# Altium schematic sheet Power Circuit.SchDoc
size A4; SheetNumber: 1; SheetTotal: 1
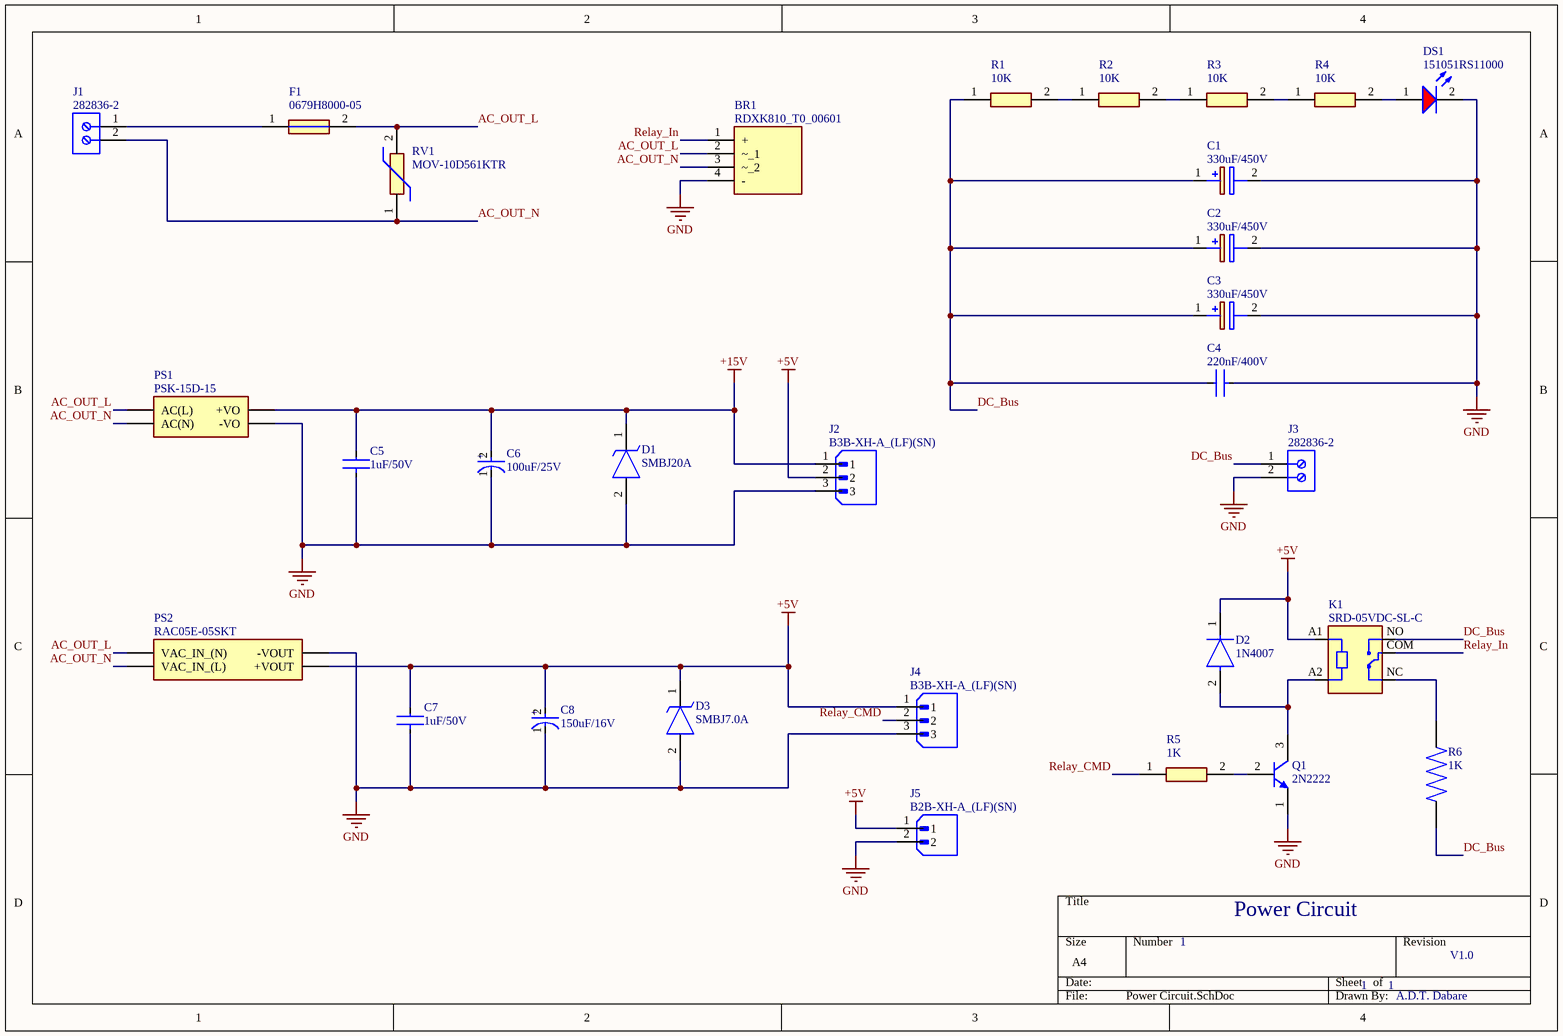
[diagram p0: Power Circuit.SchDoc]

## Parts
BR1  RDXK810_T0_00601  [RDXK810_T0_00601]
C1  330uF/450V  [CAPPRD1000W190D3050H3200]
C2  330uF/450V  [CAPPRD1000W190D3050H3200]
C3  330uF/450V  [CAPPRD1000W190D3050H3200]
C4  220nF/400V  [FP-CK06BX105K-MFG]
C5  1uF/50V  [FP-CK06BX105K-MFG]
C6  100uF/25V  [FP-RAD-TH-D_6_3_0_5-L_11-MFG]
C7  1uF/50V  [FP-CK06BX105K-MFG]
C8  150uF/16V  [FP-RAD-TH-D_6_3_0_5-L_11-MFG]
D1  SMBJ20A  [DIOM5436X244N]
D2  1N4007  [FP-1N4007-MFG]
D3  SMBJ7.0A  [DIOM5443X244N]
DS1  151051RS11000  [WL-TMRC_D5.9H8.7]
F1  0679H8000-05  [FUSC6125X279N]
J1  282836-2  [TECO-282836-2_V]
J2  B3B-XH-A_(LF)(SN)  [JST_B3B-XH-A (LF)(SN)]
J3  282836-2  [TECO-282836-2_V]
J4  B3B-XH-A_(LF)(SN)  [JST_B3B-XH-A (LF)(SN)]
J5  B2B-XH-A_(LF)(SN)  [JST_B2B-XH-A_(LF)(SN)]
K1  SRD-05VDC-SL-C  [RELAY_SRD-05VDC-SL-C]
PS1  PSK-15D-15  [PSK15D15]
PS2  RAC05E-05SKT  [RAC05E05SKT]
Q1  2N2222  [MLTC-TO-18-3]
R1  10K  [RESC6331X80N]
R2  10K  [RESC6331X80N]
R3  10K  [RESC6331X80N]
R4  10K  [RESC6331X80N]
R5  1K  [RESC3225X70N]
R6  1K  [RESAD2860W80L2200D950]
RV1  MOV-10D561KTR  [MOV10D561KTR]

## Nets
+5V: C7.2 C8.2(A) D2.1(C) D3.1(K) J2.2 J4.1 J5.1 K1.A1 PS2.7(+VOUT)
+15V: C5.2 C6.2(A) D1.1(K) J2.1 PS1.4(+VO)
GND: BR1.4(-) C1.2(-) C2.2(-) C3.2(-) C4.1 C5.1 C6.1(C) C7.1 C8.1(C) D1.2(A) D3.2(A) DS1.2(K) J2.3 J3.2 J4.3 J5.2 PS1.3(-VO) PS2.9(-VOUT) Q1.1(E)
AC_OUT_L: BR1.2(~_1) F1.2 PS1.1(AC(L)) PS2.1(VAC_IN_(N)) RV1.2
AC_OUT_N: BR1.3(~_2) J1.2 PS1.2(AC(N)) PS2.5(VAC_IN_(L)) RV1.1
DC_Bus: C1.1(+) C2.1(+) C3.1(+) C4.2 J3.1 K1.NO R1.1 R6.1
Relay_CMD: J4.2 R5.1
Relay_In: BR1.1(+) K1.COM
NetD2_2: D2.2(A) K1.A2 Q1.3(C)
NetDS1_1: DS1.1(A) R4.2
NetF1_1: F1.1 J1.1
NetK1_NC: K1.NC R6.2
NetQ1_2: Q1.2(B) R5.2
NetR1_2: R1.2 R2.1
NetR2_2: R2.2 R3.1
NetR3_2: R3.2 R4.1

## Notes on the sheet
- Power Circuit
- 1
- V1.0
- A.D.T. Dabare
- (in symbol CMP-05427-000141-1) +

## Library data of the parts
BR1 = RDXK810_T0_00601: Bridge Rectifier; Manufacturer_Name: PANJIT; Datasheet Link: https://www.panjit.com.tw/upload/datasheet/RDXK810.pdf; Height: 12.9mm; Manufacturer_Part_Number: RDXK810_T0_00601; Mouser Part Number: 241-RDXK810_T0_00601; Mouser Price/Stock: https://www.mouser.co.uk/ProductDetail/Panjit/RDXK810_T0_00601?qs=pBunHO6%252BwtELvZflFp%2FYiw%3D%3D
C1-C3 = B43647B5337M057: Capacitor Polarised; Manufacturer_Name: TDK; Datasheet Link: https://product.tdk.com/system/files/dam/doc/product/capacitor/aluminum-electrolytic/snap-in/data_sheet/20/30/db/aec/b43647.pdf; Height: 32mm; Manufacturer_Part_Number: B43647B5337M057; Mouser Part Number: 871-B43647B5337M057; Mouser Price/Stock: https://www.mouser.co.uk/ProductDetail/EPCOS-TDK/B43647B5337M057?qs=vmHwEFxEFR%2FSdH8%2FO0wcVA%3D%3D
C4 C5 C7 = CMP-03020-034658-1: CAP CER 1UF 50V BX RADIAL; Dissipation Factor: 2.5%; Lead Diameter: 0.635mm; Lead/Base Style: Straight; Pitch: 5.08mm; Tolerance: 10%; Dielectric: X7R; Radiation Hardening: No; Series: Military, MIL-C-11015, CK06; RoHS Compliant: No; Resistor Type: Ceramic; Lead Pitch: 5.08mm; Voltage Rating: 50V; Depth: 2.29mm; Length: 7.37mm; Termination: Radial; Height: 7.37mm; Package Quantity: 100; Mount: Through Hole; Construction: RADIAL; Packaging: Bulk; Capacitance: 1uF; Max Operating Temperature: 125°C; Case/Package: Molded; Voltage Rating (DC): 50V; REACH SVHC: No SVHC; Features: Military; Min Operating Temperature: -55°C; Width: 0.09inch; Number of Pins: 2; Height - Seated (Max): 0.3inch
C6 C8 = CMP-05427-000141-1: Aluminum Electrolytic Capacitors (Radial Lead Type) AEC-Q200 Qualified 100uF ±20% 25V; Lead Diameter: 0.5mm; Life (Hours): 1000Hour; Ripple Current: 130mA; Lead/Base Style: Straight; Construction: RADIAL; Radiation Hardening: No; Packaging: Ammo Pack; Termination: Radial; Mount: Through Hole; Lead Pitch: 2.5mm; Tolerance: 20%; Height - Seated (Max): 0.48inch; Height: 11.2mm; Max Operating Temperature: 105°C; Length: 11.2mm; Diameter: 6.3mm; RoHS Compliant: Yes; Voltage Rating: 25V; Min Operating Temperature: -55°C; Package Quantity: 2000; Capacitance: 100uF; Width: 6.3mm; Voltage Rating (DC): 25V; Series: NHG; Contact Plating: Tin; Case/Package: Radial
D1 = SMBJ20A: TVS Diode (Uni-directional); Manufacturer_Name: Bourns; Datasheet Link: https://www.bourns.com/docs/product-datasheets/smbj.pdf?sfvrsn=34552159_17; Height: 2.44mm; Manufacturer_Part_Number: SMBJ20A; Mouser Part Number: 652-SMBJ20A; Mouser Price/Stock: https://www.mouser.co.uk/ProductDetail/Bourns/SMBJ20A?qs=%252Bf8Cd6aE5bx0luBLnSoXTg%3D%3D; Arrow Part Number: SMBJ20A; Arrow Price/Stock: https://www.arrow.com/en/products/smbj20a/bourns?region=nac
D2 = CMP-123542-000001-1: Rectifier diode 1000 V 1 A DO-41, ,; Manufacturer: Diotec; Max Surge Forward Current: 27A; Forward Current: 1A; Max Junction Temp: +175°C; Reverse Voltage: 1000V; Value: 15pF; Peak Reverse Current: 5uA; Category: Diode; Temperature Range Low: -50°C; Automotive: No; Temperature: -50°C to +175°C; Lead Free: Yes; ComponentLink2Description: Datasheet; Max Repetitive Reverse Voltage: 1000V; ComponentLink2URL: https://datasheet.octopart.com/1N4007-Diotec-datasheet-62346875.pdf; Manufacturer Part Number: 1N4007; Device Class L3: Rectifier Diodes; Height: 2.8mm; Octopart: https://octopart.com/1n4007-diotec-4040411; Package: 1N4007; Temperature Range High: +175°C; Device Class L1: Discrete Semiconductors; Device Class L2: Diodes; RoHS: TRUE; Capacitance: 15pF; Ipc Land Pattern Name: DIOAD888W100L520D280
D3 = SMBJ7.0A: TVS Diode (Uni-directional); Manufacturer_Name: Bourns; Datasheet Link: https://www.bourns.com/docs/Product-Datasheets/SMBJ.pdf; Height: 2.44mm; Manufacturer_Part_Number: SMBJ7.0A; Mouser Part Number: 652-SMBJ7.0A; Mouser Price/Stock: https://www.mouser.co.uk/ProductDetail/Bourns/SMBJ7.0A?qs=%252Bf8Cd6aE5bwMIb6NdbDGfg%3D%3D; Arrow Part Number: SMBJ7.0A; Arrow Price/Stock: https://www.arrow.com/en/products/smbj7.0a/bourns?region=nac
DS1 = CMP-1488-00008-2: NexarPartId: 29717813; Lens Style: Circular, Diffused, Round; Lens Size: 5mm; Forward Voltage: 2.1V; Peak Wavelength: 650nm; Forward Current: 100mA; Viewing Angle: 60°; Color: Red; Wavelength: 630nm; Test Current: 20mA; Dominant Wavelength: 645nm; Luminous Intensity: 30mcd; Max Reverse Voltage (DC): 5V; Height: 8.6mm; Length: 5mm; Min Operating Temperature: -40°C; Max Operating Temperature: 85°C; Packaging: Bulk; REACH SVHC: Unknown; Case/Package: Radial; RoHS: Compliant; Width: 5mm; Mount: Through Hole
F1 = 0679H8000-05: Fuse; Manufacturer_Name: Bel Circuit Protection; Datasheet Link: https://www.mouser.ec/datasheet/2/643/ds_cp_0679h_series-1290853.pdf; Height: 2.79mm; Manufacturer_Part_Number: 0679H8000-05; Arrow Part Number: 0679H8000-05; Arrow Price/Stock: https://www.arrow.com/en/products/0679h8000-05/bel-group?region=nac
J1 J3 = CMP-1684-00017-1: Female Header, Pitch 5 mm, 1 x 2 Position, Height 10 mm, Tail Length 3.5 mm, Rohs, Bulk; Manufacturer: TE Connectivity; Wire Gauge: 16-30AWG; Product Training Modules: Wire-to-BoardEurostyleTerminalBlocks; Clamp Material - Plating: Brass-NickelPlated; Voltage: 300V; Mating Orientation: HorizontalwithBoard; Current: 13.5A; Pitch: 0.197"(5.00mm); Screw Thread: M3; 3D Model: 282836-2.pdf; Other Names: 5ULV-02B / A98076; Dynamic Catalog: BuchananSeries; Number of Levels: 1; Torque - Screw: 0.68Nm(6Lb-In); Featured Product: EurostyleTerminalBlockConnectors; Positions Per Level: 2; Wire Termination: Screw-RisingCageClamp; Datasheet URL: http://www.te.com.cn/commerce/DocumentDelivery/DDEController?Action=showdoc&DocId=Catalog+Section%7F1308389_EUROSTYLE_TERMINAL_BLOCKS%7F0607%7Fpdf%7FEnglish%7FENG_CS_1308389_EUROSTYLE_TERMINAL_BLOCKS_0607.pdf%7F282836-2; Color: Green; Family: TerminalBlocks-WiretoBoard; RoHS Information: 282836-2StatementofCompliance; Standard Package: 300; Contact Material - Plating: Brass-TinPlated; Manufacturer URL: http://www.te.com; Housing Material: Polyamide(PA66),Nylon6/6; Features: Interlocking(Side); Package Description: Female Header, Pitch 5 mm, 1 x 2 Position, Height 10 mm, Tail Length 3.5 mm; Mounting Type: ThroughHole; Package Reference: THD; Packaging: Bulk; Series: Buchanan; Category: Connectors,Interconnects; Screw Material - Plating: Brass-NickelPlated
J2 J4 = B3B-XH-A_(LF)(SN): Connector Header Through Hole 3 position 0.098 (2.50mm); MF: JST Sales America Inc.; MP: B3B-XH-A (LF)(SN); SnapEDA_Link: https://www.snapeda.com/parts/B3B-XH-A%20(LF)(SN)/JST+Sales+America+Inc./view-part/?ref=snap; Package: None; Value: *; Check_prices: https://www.snapeda.com/parts/B3B-XH-A%20(LF)(SN)/JST+Sales+America+Inc./view-part/?ref=eda
J5 = B2B-XH-A_(LF)(SN): Connector Header Through Hole 2 position 0.098 (2.50mm); MF: JST Sales; MP: B2B-XH-A (LF)(SN); SnapEDA_Link: https://www.snapeda.com/parts/B2B-XH-A%20(LF)(SN)/JST+Sales+America+Inc./view-part/?ref=snap; Package: None; Value: *; Check_prices: https://www.snapeda.com/parts/B2B-XH-A%20(LF)(SN)/JST+Sales+America+Inc./view-part/?ref=eda
K1 = SRD-05VDC-SL-C: 5V Trigger Relay Module For Arduino And Raspberry Pi 5V Trigger Relay Module For Arduino And Raspberry Pi; MF: Songle Relay; Check_prices: https://www.snapeda.com/parts/SRD-05VDC-SL-C/Songle+Relay/view-part/?ref=eda; Value: *; Availability: Not in stock; Price: None; Package: NON STANDARD-5 Songle Relay; MP: SRD-05VDC-SL-C; SnapEDA_Link: https://www.snapeda.com/parts/SRD-05VDC-SL-C/Songle+Relay/view-part/?ref=snap
PS1 = PSK-15D-15: Power Supply; Manufacturer_Name: CUI Inc.; Datasheet Link: https://www.cui.com/product/resource/psk-15d.pdf; Height: 24mm; Manufacturer_Part_Number: PSK-15D-15; Mouser Part Number: 490-PSK-15D-15; Mouser Price/Stock: https://www.mouser.co.uk/ProductDetail/CUI-Inc/PSK-15D-15?qs=DRkmTr78QATxDRJPOzDh%252BA%3D%3D
PS2 = RAC05E-05SKT: Power Supply; Manufacturer_Name: RECOM Power; Datasheet Link: https://recom-power.com/pdf/Powerline_AC-DC/RAC05E-KT.pdf; Height: 22mm; Manufacturer_Part_Number: RAC05E-05SKT; Mouser Part Number: 919-RAC05E-05SKT; Mouser Price/Stock: https://www.mouser.co.uk/ProductDetail/RECOM-Power/RAC05E-05SKT?qs=7D1LtPJG0i1k%2FYw%252BRylc5g%3D%3D; Arrow Part Number: RAC05E-05SKT; Arrow Price/Stock: https://www.arrow.com/en/products/rac05e-05skt/recom-power?region=nac
Q1 = CMP-2000-05237-1: Low Power Bipolar NPN Transistor, 30 V, -65 to 200 degC, 3-Pin TO-18, RoHS, Bulk; Manufacturer: Multicomp; Pin Configuration: a; No. of Pins: 3; No. of Transistors: 1; Collector Emitter Voltage Vces: 400mV; Current Ic Continuous a Max: 800mA; Power Dissipation Pd: 500mW; Collector Emitter Voltage V(br)ceo: 30V; Gain Bandwidth ft Typ: 250MHz; Voltage Vcbo: 60V; DC Current Gain hFE: 100; Full Power Rating Temperature: 25degC; Current Ic @ Vce Sat: 150mA; SVHC: NoSVHC(19-Dec-2012); Package Reference: TO-18-3; Package Description: 3-Pin Transistor Outline Package (TO-18), Dia 5.54 mm, Pitch Pitch 1.485mm; Datasheet URL: http://www.farnell.com/datasheets/1662272.pdf; Transistor Case Style: TO-18; Continuous Collector Current Ic Max: 800mA; Manufacturer URL: http://uk.farnell.com/b/multicomp; DC Collector Current: 800mA; Hfe Min: 100; Transistor Polarity: NPN; Power Dissipation Ptot Max: 500mW; Package / Case: TO-18; Datasheet Version: Rev. 1.1, 05/2012; Gain Bandwidth ft Min: 250MHz; Current Ic hFE: 150mA
R1-R4 = CRM2512QJW-103ELF: Resistor; Manufacturer_Name: Bourns; Datasheet Link: http://www.bourns.com/data/global/pdfs/CRM0805_1206_2010.pdf; Height: 0.8mm; Manufacturer_Part_Number: CRM2512QJW-103ELF; Mouser Part Number: 652-CRM2512QJW-103E; Mouser Price/Stock: https://www.mouser.co.uk/ProductDetail/Bourns/CRM2512QJW-103ELF?qs=8Wlm6%252BaMh8Rzg3bRHdWGsA%3D%3D; Arrow Part Number: CRM2512QJW-103ELF; Arrow Price/Stock: https://www.arrow.com/en/products/crm2512qjw-103elf/bourns?region=nac
R5 = ERJ-T14LK102U: Resistor; Manufacturer_Name: Panasonic; Datasheet Link: https://componentsearchengine.com/Datasheets/1/ERJ-T14LK102U.pdf; Height: 0.7mm; Manufacturer_Part_Number: ERJ-T14LK102U; Mouser Part Number: 667-ERJ-T14LK102U; Mouser Price/Stock: https://www.mouser.co.uk/ProductDetail/Panasonic/ERJ-T14LK102U?qs=69hQ%2F0d5SwhjOR8VGTtd5Q%3D%3D
R6 = SQP500JB-1K: MF: {'manufacturer': u'YAGEO'}; Package: None; Price: None; Value: *; MP: SQP500JB-1K; Availability: Unavailable
RV1 = MOV-10D561KTR: Varistor; Manufacturer_Name: Bourns; Datasheet Link: https://www.bourns.com/docs/Product-Datasheets/MOV10D.pdf; Height: 15.5mm; Manufacturer_Part_Number: MOV-10D561KTR; Mouser Part Number: 652-MOV-10D561KTR; Mouser Price/Stock: https://www.mouser.co.uk/ProductDetail/Bourns/MOV-10D561KTR?qs=lgttKnAd%252B2CzitieoxdOpg%3D%3D